# Altium schematic sheet Power.SchDoc
size A4; SheetNumber: 2; SheetTotal: 3
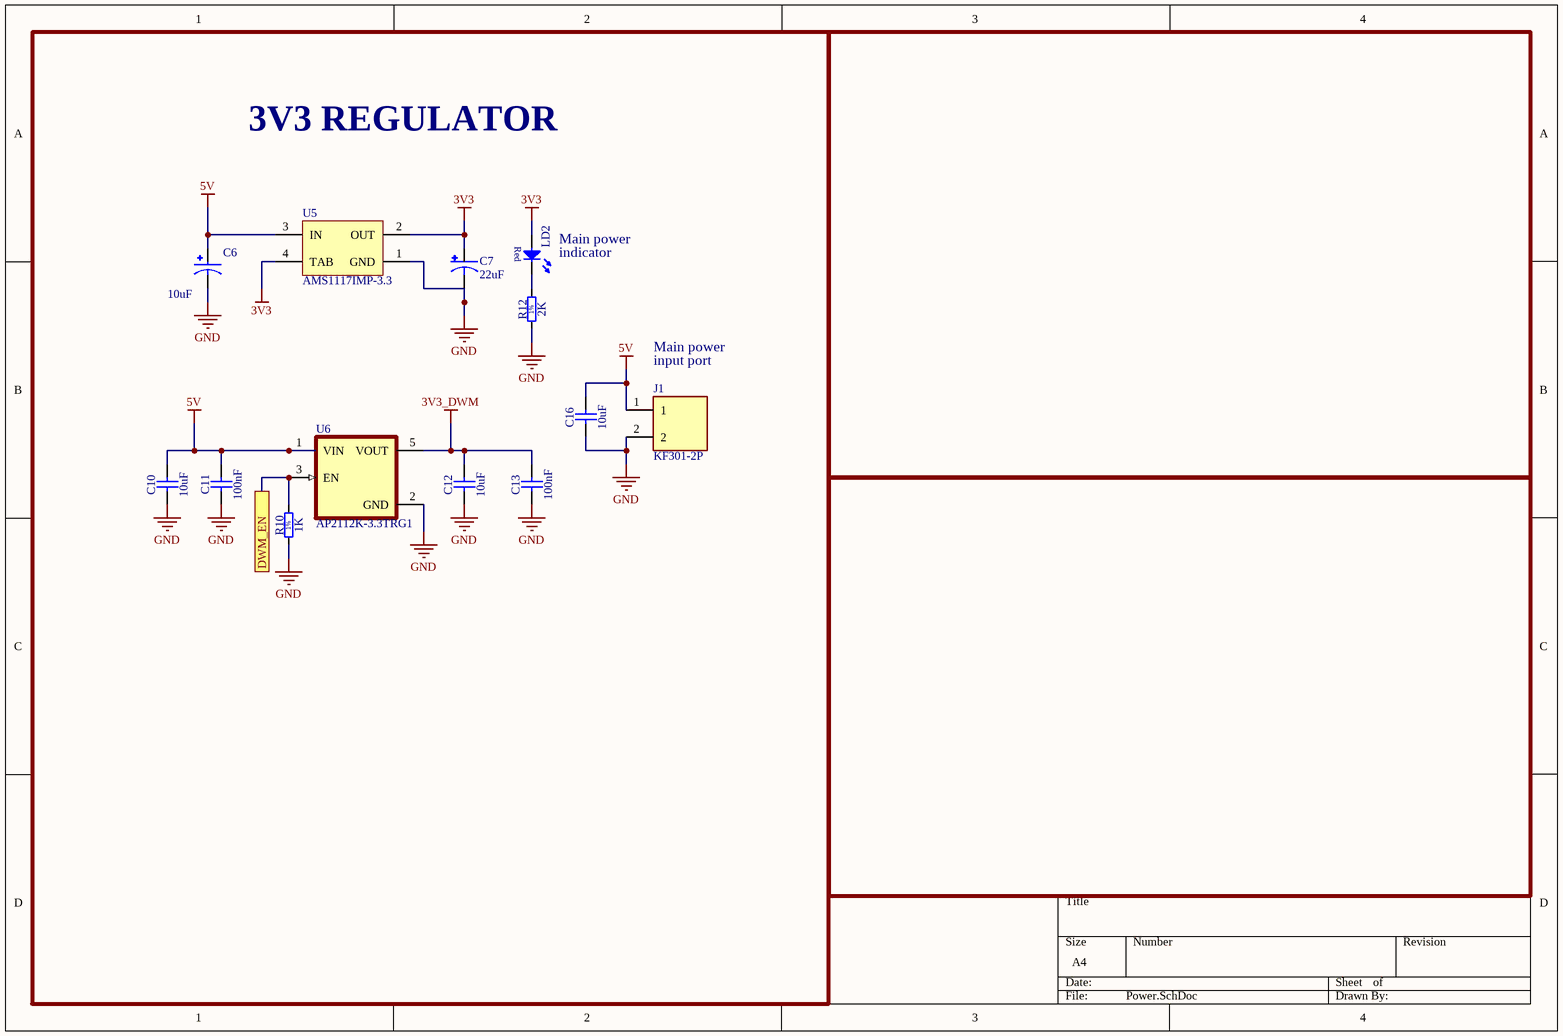
[diagram p0: Power.SchDoc]

## Parts
C6  10uF  [CAPMP3216X180N]
C7  22uF  [CAPMP3528X210N]
C10  10uF  [0603C]
C11  100nF  [0603C]
C12  10uF  [0603C]
C13  100nF  [0603C]
C16  10uF  [0603C]
J1  KF301-2P  [HANDSON_KF301-2P]
LD2  (no value)  [0603 LED]
R10  1K  [0603R]
R12  2K  [0603R]
U5  AMS1117IMP-3.3  [VREG_LM1117IMP-3.3/NOPB]
U6  AP2112K-3.3TRG1  [SOT95P285X140-5N]

## Ports
DWM_EN

## Nets
3V3: C7.1 LD2.2(A) U5.2(OUT) U5.4(TAB)
3V3_DWM: C12.2 C13.2 U6.5(VOUT)
5V: C6.1 C10.2 C11.2 C16.2 J1.1 U5.3(IN) U6.1(VIN)
GND: C6.2 C7.2 C10.1 C11.1 C12.1 C13.1 C16.1 J1.2 R10.1 R12.1 U5.1(GND) U6.2(GND)
DWM_EN: R10.2 U6.3(EN) ; port DWM_EN
NetLD2_1: LD2.1(C) R12.2

## Notes on the sheet
- 3V3 REGULATOR
- (near LD2) Main power
- indicator
- Main power
- (near J1) input port
- (in symbol LED Red 1C 2A) Red
- (in symbol Resistor - 1%_1) 1%

## Library data of the parts
C6 = T543A106K010ATW080: 10 ÂµF Molded Tantalum Polymer Capacitor 10 V 1206 (3216 Metric) 80mOhm @ 100kHz; MF: KEMET; SnapEDA_Link: https://www.snapeda.com/parts/T543A106K010ATW080/Kemet/view-part/?ref=snap; Package: SMD-2 Kemet; Value: *; MP: T543A106K010ATW080; Check_prices: https://www.snapeda.com/parts/T543A106K010ATW080/Kemet/view-part/?ref=eda
C7 = TPSB226K016R0600: Capacitor,Tantalum,Cap 22 uF,Tol 10%,Vol-Rtg 16 VDC,SMT,3528,ESR 600 mOhms,CT | AVX TPSB226K016R0600; SnapEDA_Link: https://www.snapeda.com/parts/TPSB226K016R0600/AVX/view-part/?ref=snap; Package: 1210 AVX; Value: *; MF: AVX; MP: TPSB226K016R0600; Check_prices: https://www.snapeda.com/parts/TPSB226K016R0600/AVX/view-part/?ref=eda
C10-C13 C16 = Capacitor - non polarized: Non-polarised capacitor
J1 = KF301-2P: 2 Pin Terminal Block 5mm Pitch; MF: Handson Technology; SnapEDA_Link: https://www.snapeda.com/parts/KF301-2P/Handson+Technology/view-part/?ref=snap; Package: None; Value: *; MP: KF301-2P; Check_prices: https://www.snapeda.com/parts/KF301-2P/Handson+Technology/view-part/?ref=eda
LD2 = LED Red 1C 2A
R10 R12 = Resistor - 1%_1: Resistor - 1%
U5 = LM1117IMP-3.3: 800mA Low-Dropout Linear Regulator, 4-pin SOT-223; Manufacturer: National Semiconductor; PackageTopMarking: XYTT*N05B; PowerWise: N; CompType: LDO IC; High-Reliability: Y; DatasheetVersion: Apr-2006; PackageVersion: revB, Apr-2003; PackageReference: MP04A; PackageDescription: Molded SOT-223, 6.50 x 3.56 x 1.6mm Body, 4 Lead, 2.3mm Pitch; PartNumber: LM1117IMP-3.3; RoHS: N; PinCount: 4; Code_JEDEC: TO-261-AA; Code_IPC: SOT223-4; ComponentLink1Description: Manufacturer URL; ComponentLink1URL: http://www.national.com/; ComponentLink2Description: LM1117 Datasheet; ComponentLink2URL: http://www.national.com/ds/LM/LM1117.pdf; ComponentLink3Description: LM1117 Web Page; ComponentLink3URL: http://www.national.com/pf/LM/LM1117.html; ComponentLink4Description: MP04A Package Page; ComponentLink4URL: http://www.national.com/packaging/folders/mp04a.html
U6 = AP2112K-3.3TRG1: Linear Voltage Regulator IC Positive Fixed 1 Output 600mA SOT-25; MF: Diodes Inc.; Value: *; Purchase-URL: https://pricing.snapeda.com/search/part/AP2112K-3.3TRG1/?ref=eda; Package: SOT-753 Diodes Inc.; Availability: In Stock; Check_prices: https://www.snapeda.com/parts/AP2112K-3.3TRG1/Diodes+Inc./view-part/?ref=eda; Price: None; SnapEDA_Link: https://www.snapeda.com/parts/AP2112K-3.3TRG1/Diodes+Inc./view-part/?ref=snap; MP: AP2112K-3.3TRG1